# EAGLE design Jetson_RTC-module (EAGLE 7.5.0)
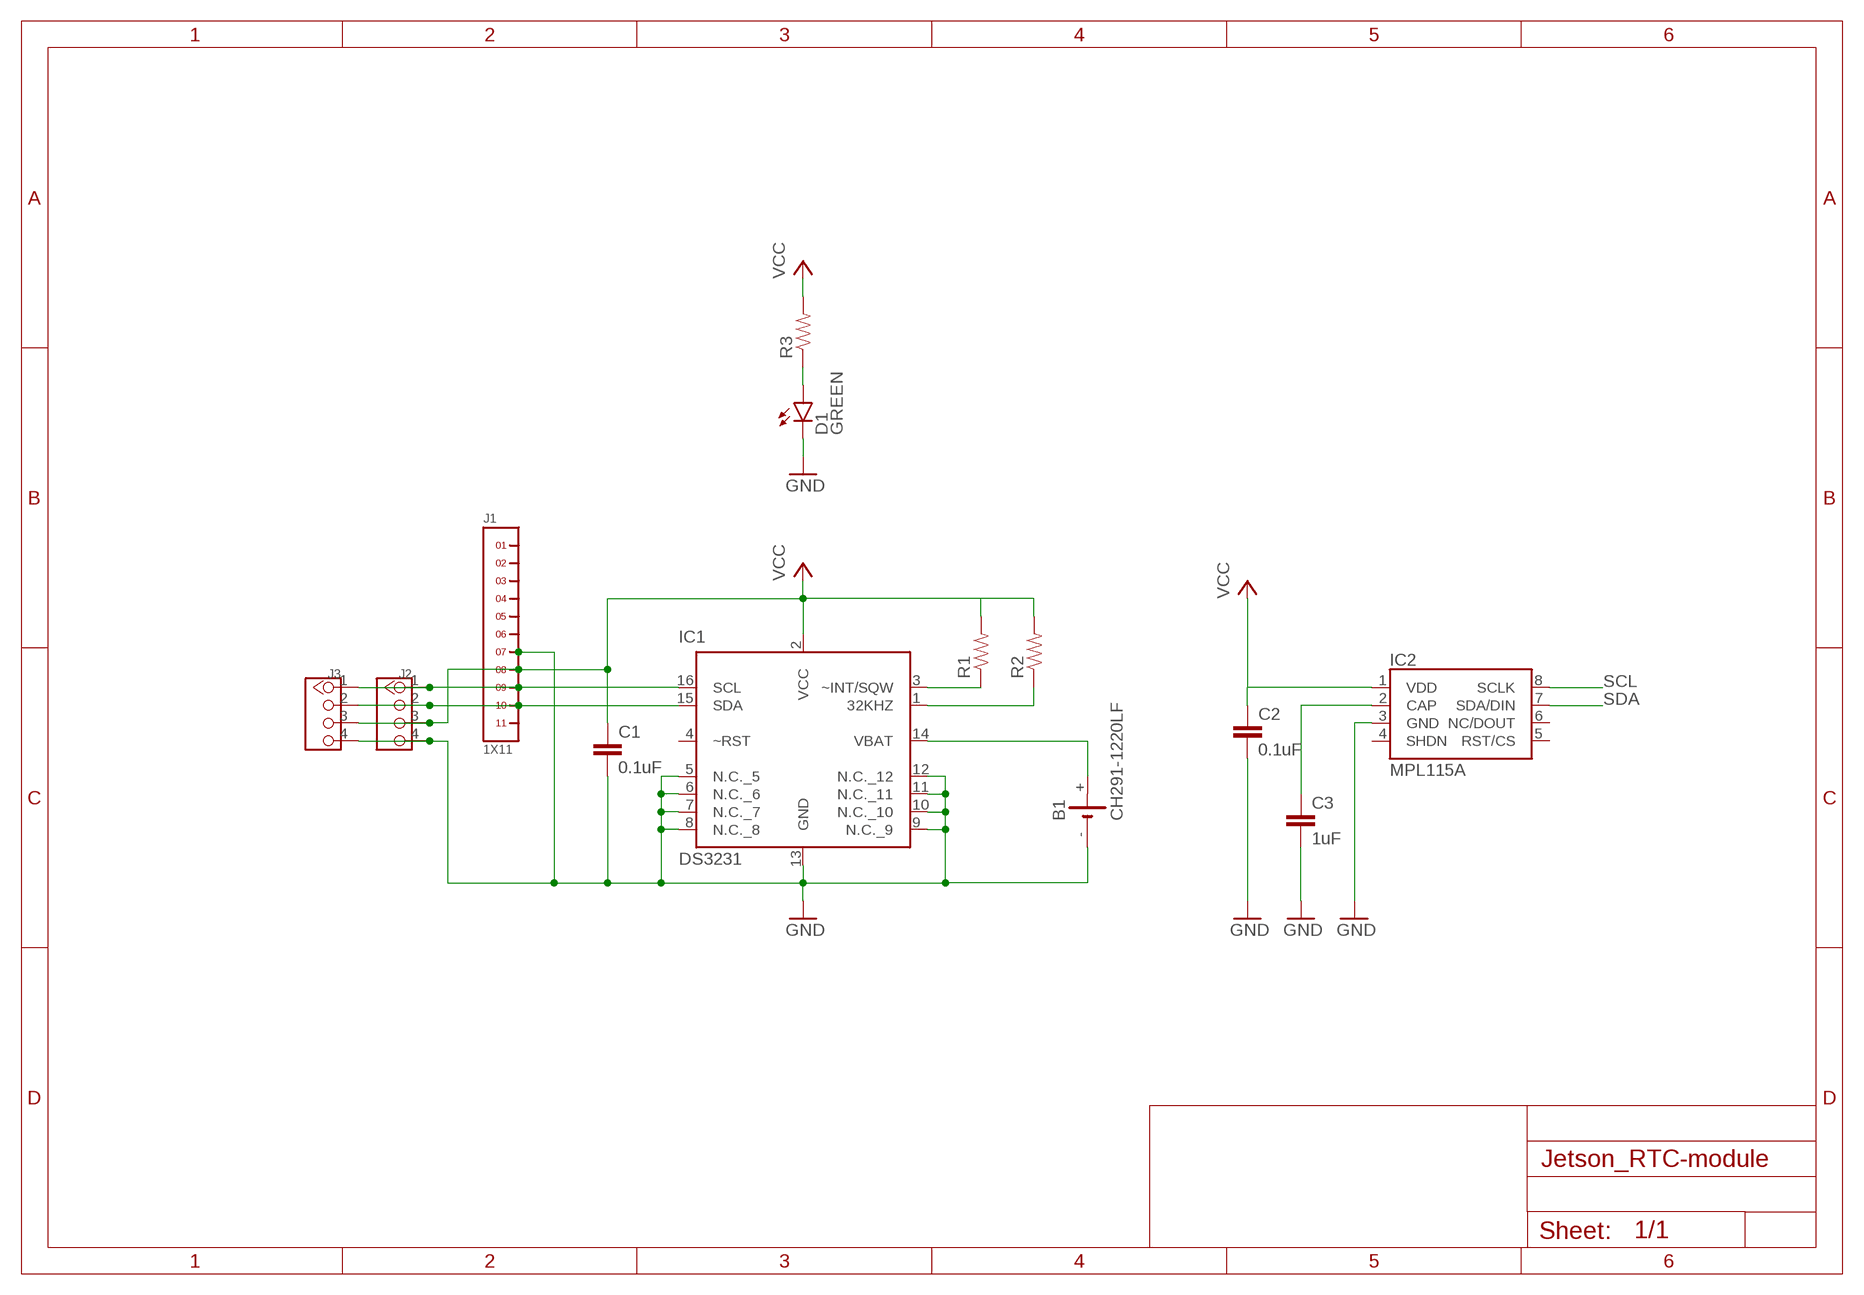
[diagram p0: schematic, sheet 1]

## Parts
B1  CH291-1220LF  [CH291-1220LF]
C1  0.1uF  C-EUC1608  [C1608]
C2  0.1uF  C-EUC1608  [C1608]
C3  1uF  C-EUC1608  [C1608]
D1  GREEN  LED-GREEN0603  [LED-0603]
IC1  DS3231  [SO16L]
IC2  MPL115A  [LGA8]
J1  1X11  [1X11]
J2  TWIG-4P-2.0-2.0  [4P-2.0]
J3  TWIG-4P-2.0-2.0  [4P-2.0]
R1  RESISTOR0603  [0603-RES]
R2  RESISTOR0603  [0603-RES]
R3  RESISTOR0603  [0603-RES]

## Nets
GND: B1.- C1.2 C2.2 C3.2 D1.C IC1.5(N.C._5) IC1.6(N.C._6) IC1.7(N.C._7) IC1.8(N.C._8) IC1.9(N.C._9) IC1.10(N.C._10) IC1.11(N.C._11) IC1.12(N.C._12) IC1.13(GND) IC2.3(GND) J1.7 J2.4 J3.4
N$1: B1.+ IC1.14(VBAT)
N$2: IC1.1(32KHZ) R2.1
N$3: IC1.3(~INT/SQW) R1.1
N$4: C3.1 IC2.2(CAP)
N$6: D1.A R3.1
SCL: IC1.16(SCL) IC2.8(SCLK) J1.9 J2.1 J3.1
SDA: IC1.15(SDA) IC2.7(SDA/DIN) J1.10 J2.2 J3.2
VCC: C1.1 C2.1 IC1.2(VCC) IC2.1(VDD) J1.8 J2.3 J3.3 R1.2 R2.2 R3.2
Unconnected: IC1.4(~RST) IC2.4(SHDN) IC2.5(RST/CS) IC2.6(NC/DOUT) J1.1 J1.2 J1.3 J1.4 J1.5 J1.6 J1.11

## Library data of the parts
B1 = battery:CH291-1220LF: Battery Holder, SMT, 12mm multicomp PART NO. CH291-1220LF Source: Data sheet <http://www.farnell.com/datasheets/1505860.pdf>
C1-C3 = rcl:C-EU: CAPACITOR, European symbol
D1 = SparkFun-LED:LED-GREEN: Various green LEDs Green LEDs used in SFE Production 0603- DIO-00821 LARGE- DIO-00862 LILYPAD- DIO-09910; PROD_ID: DIO-00821
IC1 = DS3231:DS3231: I2C-integrated RTC with TCXO and Crystal Source: http://datasheets.maximintegrated.com/en/ds/DS3231.pdf
IC2 = SparkFun-Sensors:MPL115A: MPL115A1 (SPI) and MPL115A2 (I2C) Miniature Digital Barometer 5.0x3.0x1.2mm LGA Package
J1 = headers(2mm):1X11
J2 J3 = Connector:TWIG-4P-2.0
R1-R3 = SparkFun-Resistors:RESISTOR: Resistor Basic schematic elements and footprints for 0603, 1206, and PTH resistors.

## Board
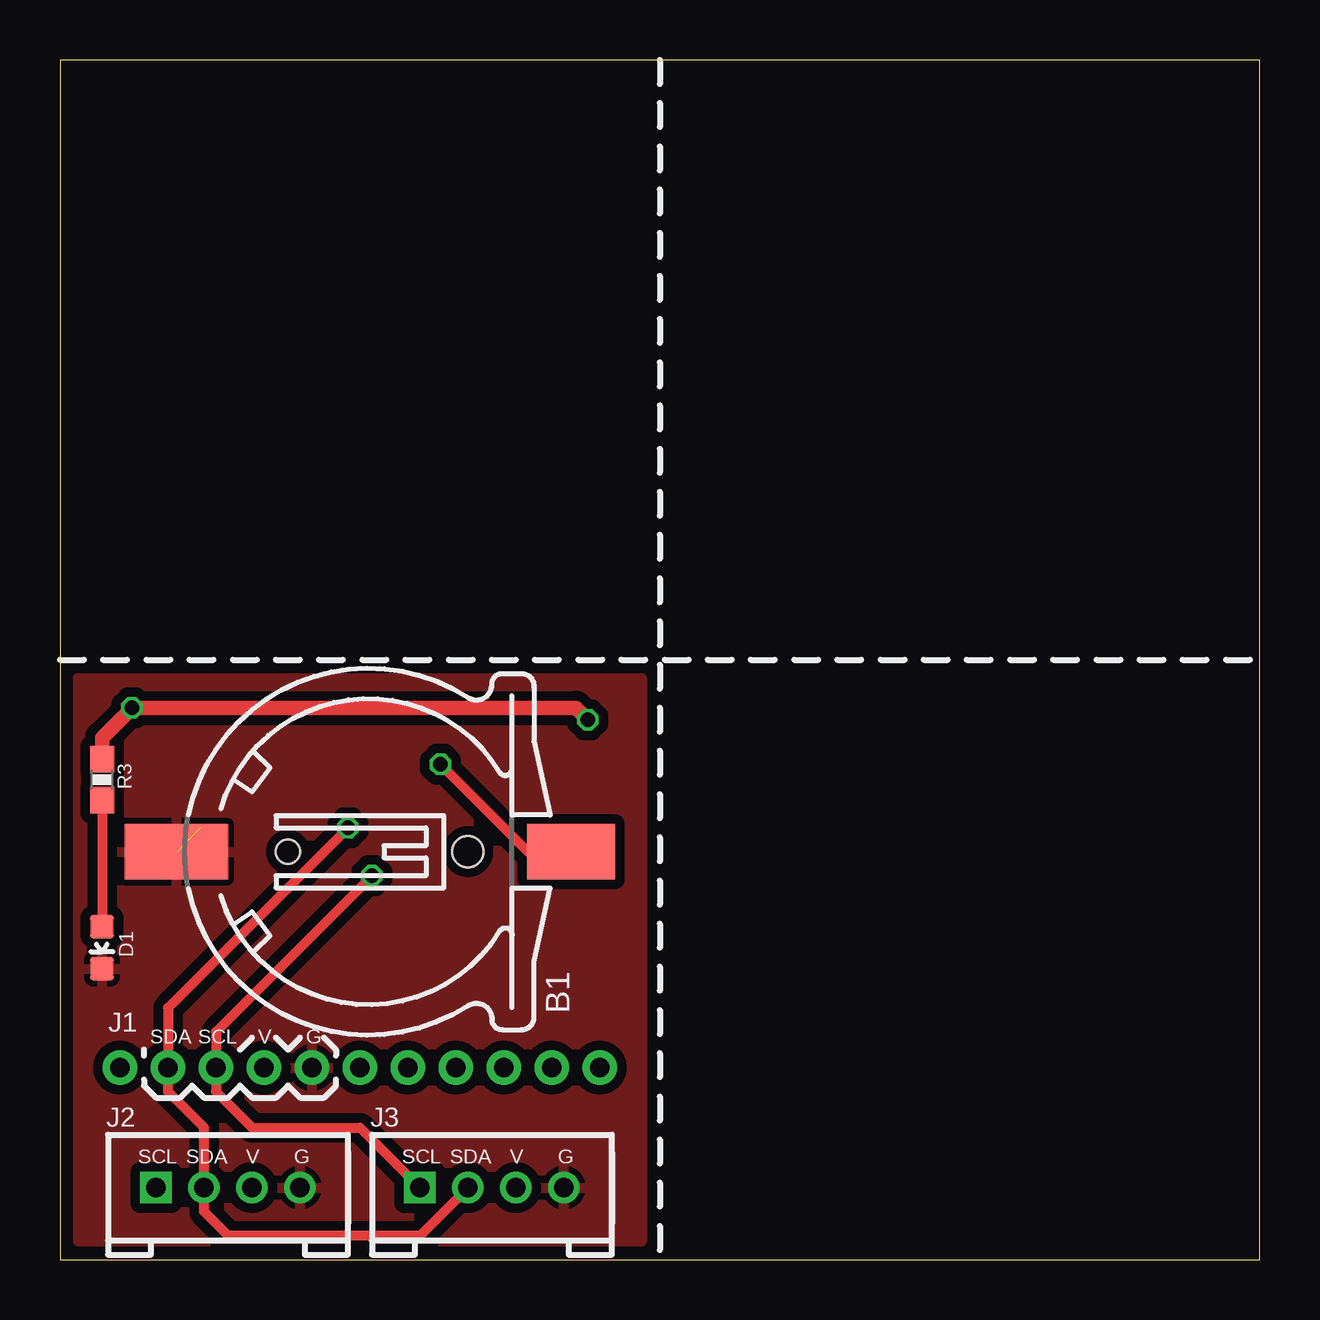
[diagram p1: board, top side]
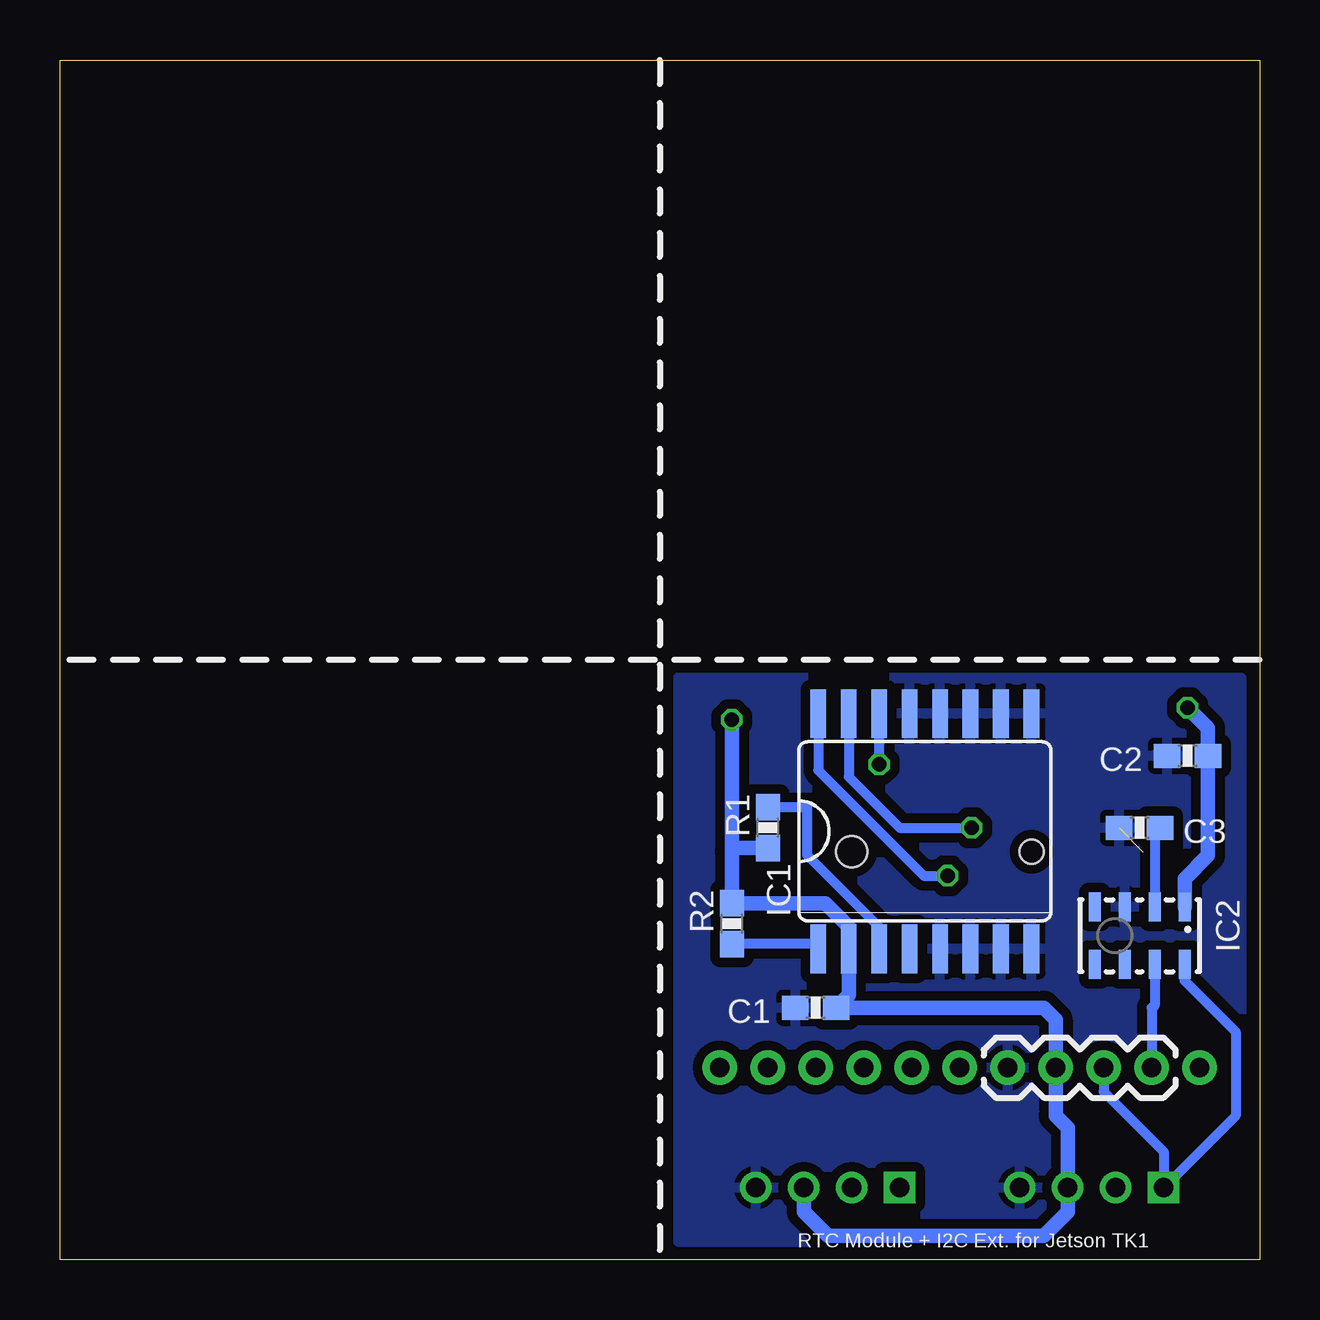
[diagram p2: board, bottom side, seen from below]

Size 50 x 50 mm. Coordinates in mm from the lower left corner, seen from the top.
Outline: 0,0 50,0 50,50 0,50 0,0
Copper layers (1*16): Top 0.035mm / dielectric 1.5mm / Bottom 0.035mm
Design rules "SeeedStudio_2layer_DRU_no_angle_20140221": minimum track width 6mil, minimum drill 12mil, track to track 6mil, track to pad 6mil, pad to pad 6mil, via to via 6mil, smd to smd 0mil, copper to edge 10mil, drill to drill 10mil, minimum pad ring 10mil, minimum via ring 6mil, stop-mask expansion 2mil, vias tented up to drill 100mil, thermal gap 10mil

### Footprints (pad centres in the part's own frame; a part is rotated, then mirrored left to right if it is on the bottom)
CH291-1220LF = smd 2.3 x 3.66: + 0,-2.296 | smd 2.3 x 4.3: - 0,14.146 | hole 1.3: 0,2 | hole 1: 0,9.5
C1608 = smd 1.1 x 1: 1 -0.85,0; 2 0.85,0
LED-0603 = smd 1 x 1: A 0,-0.877; C 0,0.877
SO16L = smd 0.66 x 2.032: 1 -4.445,-4.902; 2 -3.175,-4.902; 3 -1.905,-4.902; 4 -0.635,-4.902; 5 0.635,-4.902; 6 1.905,-4.902; 7 3.175,-4.902; 8 4.445,-4.902; 9 4.445,4.902; 10 3.175,4.902; 11 1.905,4.902; 12 0.635,4.902; 13 -0.635,4.902; 14 -1.905,4.902; 15 -3.175,4.902; 16 -4.445,4.902
LGA8 = smd 1.2 x 0.5: 1 -1.2,1.875; 2 -1.2,0.625; 3 -1.2,-0.625; 4 -1.2,-1.875; 5 1.2,-1.875; 6 1.2,-0.625; 7 1.2,0.625; 8 1.2,1.875
1X11 = drill 0.8 pad 1.422: 1 -10,0; 2 -8,0; 3 -6,0; 4 -4,0; 5 -2,0; 6 0,0; 7 2,0; 8 4,0; 9 6,0; 10 8,0; 11 10,0
4P-2.0 = drill 0.8 pad 1.27 square: 1 -3,0 | drill 0.8 pad 1.27: 2 -1,0; 3 1,0; 4 3,0
0603-RES = smd 1.1 x 1: 1 -0.85,0; 2 0.85,0

### Placement (x,y rotation side)
B1  19,17 90 top
C1  18.5,10.5 180 bottom
C2  3,21 180 bottom
C3  5,18 180 bottom
D1  1.75,13 180 top
IC1  13.95,17.85 0 bottom
IC2  5,13.5 270 bottom
J1  12.5,8 0 bottom
J2  7,3 0 top
J3  18,3 0 top
R1  20.5,18 270 bottom
R2  22,14 90 bottom
R3  1.75,20 90 top

### Tracks (layer width: path | path; a pad name or v marks a point on that pad's centre or on a via)
GND  (1 unrouted)
  pour Bottom (isolate 0.406): 0.75,24.25 24.25,24.25 24.25,0.75 0.75,0.75
  pour Top (isolate 0.406): 0.75,24.25 24.25,24.25 24.25,0.75 0.75,0.75
N$1  (via drill 0.6)
  Top 0.406: v15.86,20.64 19.5,17 B1.+
  Bottom 0.406: IC1.14 v15.86,20.64
N$2
  Bottom 0.406: IC1.1 18.6,13.15 R2.1
N$3
  Bottom 0.406: IC1.3 15.86,13.86 18.85,16.85 18.85,18.85 R1.1
N$4
  Bottom 0.406: C3.1 4.38,18 IC2.2
N$6
  Top 0.406: R3.1 D1.A
SCL  (via drill 0.6)
  Top 0.406: v13,16 6.5,9.5 J1.9 6.5,7 8,5.5 12.5,5.5 J3.1
  Bottom 0.406: IC1.16 18.39,20.39 14,16 v13,16 | IC2.8 3.12,11.62 1,9.5 1,6 J2.1 4,4.5 6.5,7 J1.9
SDA  (via drill 0.6)
  Top 0.406: J3.2 15,1 7,1 6,2 J2.2 6,5.5 4.5,7 J1.10 4.5,10.5 v12,18
  Bottom 0.406: IC1.15 17.12,20.12 15,18 v12,18 | IC2.7 4.38,10.62 arc90 4.5,10.5 J1.10
VCC  (via drill 0.6)
  Top 0.61: v22,22.5 21.5,23 v3,23 1.75,21.75 R3.2
  Bottom 0.406: 21.85,17.15 22,17 | 17.12,13.88 IC1.2
  Bottom 0.61: J3.3 19,2 18,1 9,1 8,2 J2.3 8,5.5 8.5,6 J1.8 8.5,10 9,10.5 C1.1 17.12,11.03 IC1.2 | v3,23 2.15,22.15 C2.1 2.15,16.85 3.12,15.88 IC2.1 | v22,22.5 22,17 R2.2 18.1,14.85 17.12,13.88 | R1.2 21.85,17.15

### Text on the board
tPlace: J1
bPlace: RTC Module + I2C Ext. for Jetson TK1
tNames: SDA | SCL | V | G | SCL | SDA | V | G | SCL | SDA | V | G